# Altium schematic sheet Power.SchDoc
size A4; SheetNumber: 7; SheetTotal: 7
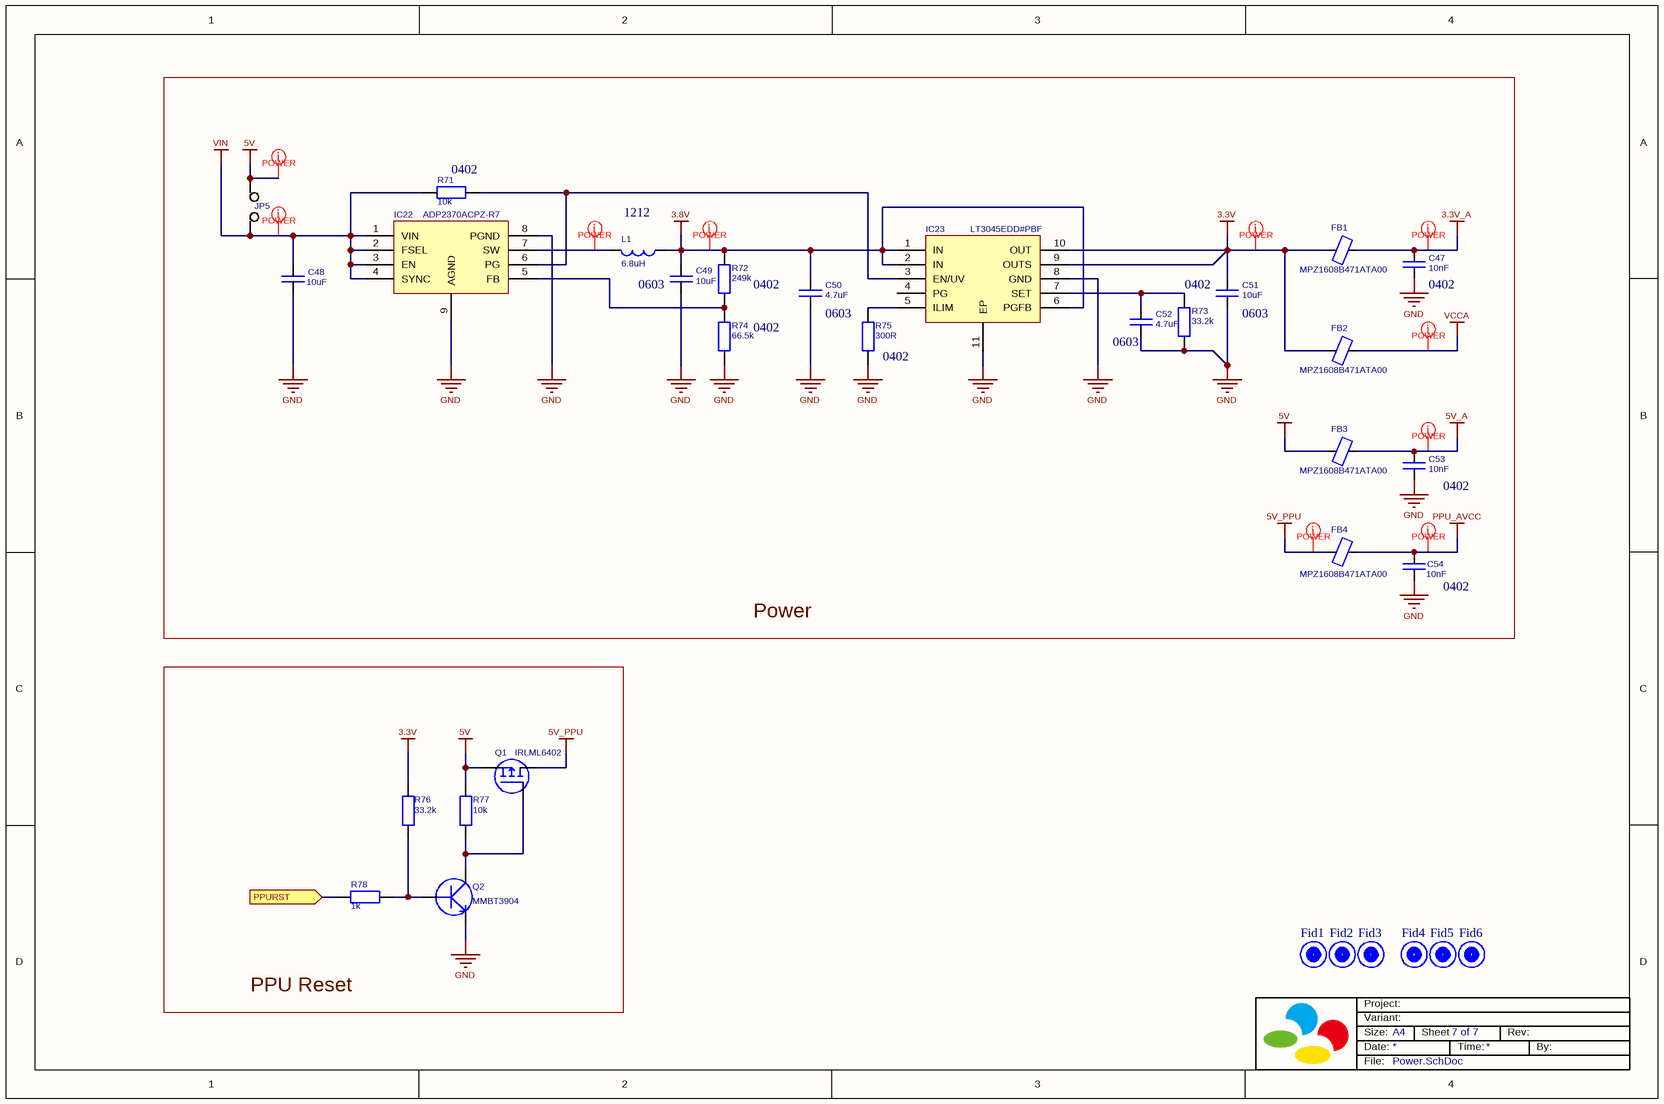
[diagram p0: Power.SchDoc]

## Parts
C47  value 10nF  [Cap_0402_Chip]  (hidden comment: Ceramic Capacitor 10nF 10V ±20% X7R 0402)
C48  value 10uF  [Cap_0805_Chip]  (hidden comment: Ceramic Capacitor 10uF 25V ±20% X5R 0805)
C49  value 10uF  [Cap_0603_Chip]  (hidden comment: Ceramic Capacitor 10uF 10V ±20% X5R 0603)
C50  value 4.7uF  [Cap_0603_Chip]  (hidden comment: Ceramic Capacitor 4.7uF 10V ±20% X5R 0603)
C51  value 10uF  [Cap_0603_Chip]  (hidden comment: Ceramic Capacitor 10uF 10V ±20% X5R 0603)
C52  value 4.7uF  [Cap_0603_Chip]  (hidden comment: Ceramic Capacitor 4.7uF 10V ±20% X5R 0603)
C53  value 10nF  [Cap_0402_Chip]  (hidden comment: Ceramic Capacitor 10nF 10V ±20% X7R 0402)
C54  value 10nF  [Cap_0402_Chip]  (hidden comment: Ceramic Capacitor 10nF 10V ±20% X7R 0402)
FB1  Manufacturer_Part_Number: MPZ1608B471ATA00  [Ind_0603_Chip]  (hidden comment: 470Ohm  1A)
FB2  Manufacturer_Part_Number: MPZ1608B471ATA00  [Ind_0603_Chip]  (hidden comment: 470Ohm  1A)
FB3  Manufacturer_Part_Number: MPZ1608B471ATA00  [Ind_0603_Chip]  (hidden comment: 470Ohm  1A)
FB4  Manufacturer_Part_Number: MPZ1608B471ATA00  [Ind_0603_Chip]  (hidden comment: 470Ohm  1A)
Fid1  Fiducial  [Fiducial_1_side]  (value not drawn)  (no BOM)
Fid2  Fiducial  [Fiducial_1_side]  (value not drawn)  (no BOM)
Fid3  Fiducial  [Fiducial_1_side]  (value not drawn)  (no BOM)
Fid4  Fiducial  [Fiducial_1_side]  (value not drawn)  (no BOM)
Fid5  Fiducial  [Fiducial_1_side]  (value not drawn)  (no BOM)
Fid6  Fiducial  [Fiducial_1_side]  (value not drawn)  (no BOM)
IC22  Manufacturer_Part_Number: ADP2370ACPZ-R7  [LFCSP8]  (hidden comment: ADP2370)
IC23  Manufacturer_Part_Number: LT3045EDD#PBF  [DFN10]  (hidden comment: LT3045)
JP5  Jumper  [Jumper Big]  (value not drawn)  (no BOM)
L1  value 6.8uH  [WE-MAPI_3020]  (hidden comment: 0603)
Q1  IRLML6402  [SOT23_FET]
Q2  MMBT3904  [SOT23_Transistor]
R71  value 10k  [Res_0402_Chip]  (hidden comment: Resistor 10k 0402 ±1%)
R72  value 249k  [Res_0402_Chip]  (hidden comment: Resistor 249k 0402 ±1%)
R73  value 33.2k  [Res_0402_Chip]  (hidden comment: Resistor 33.2k 0402 ±1%)
R74  value 66.5k  [Res_0402_Chip]  (hidden comment: Resistor 66.5k 0402 ±1%)
R75  value 300R  [Res_0402_Chip]  (hidden comment: Resistor 300R 0402 ±1%)
R76  value 33.2k  [Res_0402_Chip]  (hidden comment: Resistor 33.2k 0402 ±1%)
R77  value 10k  [Res_0402_Chip]  (hidden comment: Resistor 10k 0402 ±1%)
R78  value 1k  [Res_0402_Chip]  (hidden comment: Resistor 1k 0402 ±1%)

## Blocks framed on the sheet
Power: C47-C54 FB1-FB4 IC22 IC23 JP5 L1 R71-R75
PPU Reset: Q1 Q2 R76-R78

## Ports
PPURST (in)

## Nets
3.3V: C51.2 FB1.1 FB2.1 IC23.9(OUTS) IC23.10(OUT) R76.2
3.3V_A: C47.1 FB1.2
3.8V: C49.2 C50.2 IC23.1(IN) IC23.2(IN) IC23.6(PGFB) L1.2 R72.1
5V: FB3.1 JP5.1 Q1.S R77.1
5V_A: C53.1 FB3.2
5V_PPU: FB4.1 Q1.D
GND: C47.2 C48.1 C49.1 C50.1 C51.1 C52.1 C53.2 C54.2 IC22.8(PGND) IC22.9(AGND) IC23.8(GND) IC23.11(EP) Q2.E R73.2 R74.2 R75.2
PPU_AVCC: C54.1 FB4.2
VCCA: FB2.2
VIN: C48.2 IC22.1(VIN) IC22.2(FSEL) IC22.3(EN) IC22.4(SYNC) JP5.2 R71.1
PPURST: R78.1 ; port PPURST
NetC52_2: C52.2 IC23.7(SET) R73.1
NetIC22_5: IC22.5(FB) R72.2 R74.1
NetIC22_6: IC22.6(PG) IC23.3(EN/UV) R71.2
NetIC22_7: IC22.7(SW) L1.1
NetIC23_5: IC23.5(ILIM) R75.1
NetQ1_G: Q1.G Q2.C R77.2
NetQ2_B: Q2.B R76.1 R78.2

Not connected (* = marked no-connect by the designer): IC23 4(PG)

## Layout directives
net class POWER: 3.3V, 3.3V_A, 3.8V, 5V, 5V_A, 5V_PPU, NetIC22_7, PPU_AVCC, VCCA, VIN

## Notes on the sheet
- (near R71) 0402
- (near L1) 1212
- 0603
- 0402
- (near C51) 0603
- (near C47) 0402
- (near R75) 0402
- (near C52) 0603
- (near C53) 0402
- (near C54) 0402
- Size:
- Date:
- Variant:
- Project:
- A4
- Sheet
- Time:
- Rev:
- By:
- File:

## Library data of the parts
C47 C53 C54 = Capacitor: ChipSize: 0402; NominalVoltage: 10V; Dielectric: X7R; Tolerance: ±20%; PartType: Ceramic Capacitor
C48 = Capacitor: ChipSize: 0805; NominalVoltage: 25V; Dielectric: X5R; Tolerance: ±20%; PartType: Ceramic Capacitor
C49-C52 = Capacitor: ChipSize: 0603; NominalVoltage: 10V; Dielectric: X5R; Tolerance: ±20%; PartType: Ceramic Capacitor
FB1-FB4 = Ferrite Bead: Manufacturer: TDK; Value: 470Ohm  1A
IC22 = ADP2370: SMPS; Manufacturer: Analog Devices Inc
IC23 = LT3045: LDO; Manufacturer: Analog Devices Inc
L1 = L: Manufacturer: Würth; Manufacturer_Part_Number: 74438336068
Q1 = Mosfet1: Manufacturer: Diodes; Manufacturer_Part_Number: IRLML6402
Q2 = T_NPN: Manufacturer: Diodes; Manufacturer_Part_Number: MMBT3904
R71-R78 = R: ChipSize: 0402; Tolerance: ±1%; PartType: Resistor